# Altium schematic sheet Fri3d_2024_Exp0_01.SchDoc: Communicator Add-On
size A3; Date: 18/06/2024; DrawnBy: Wim Van Gool; DocumentNumber: 1; Revision: 01; SheetNumber: 1; SheetTotal: 2
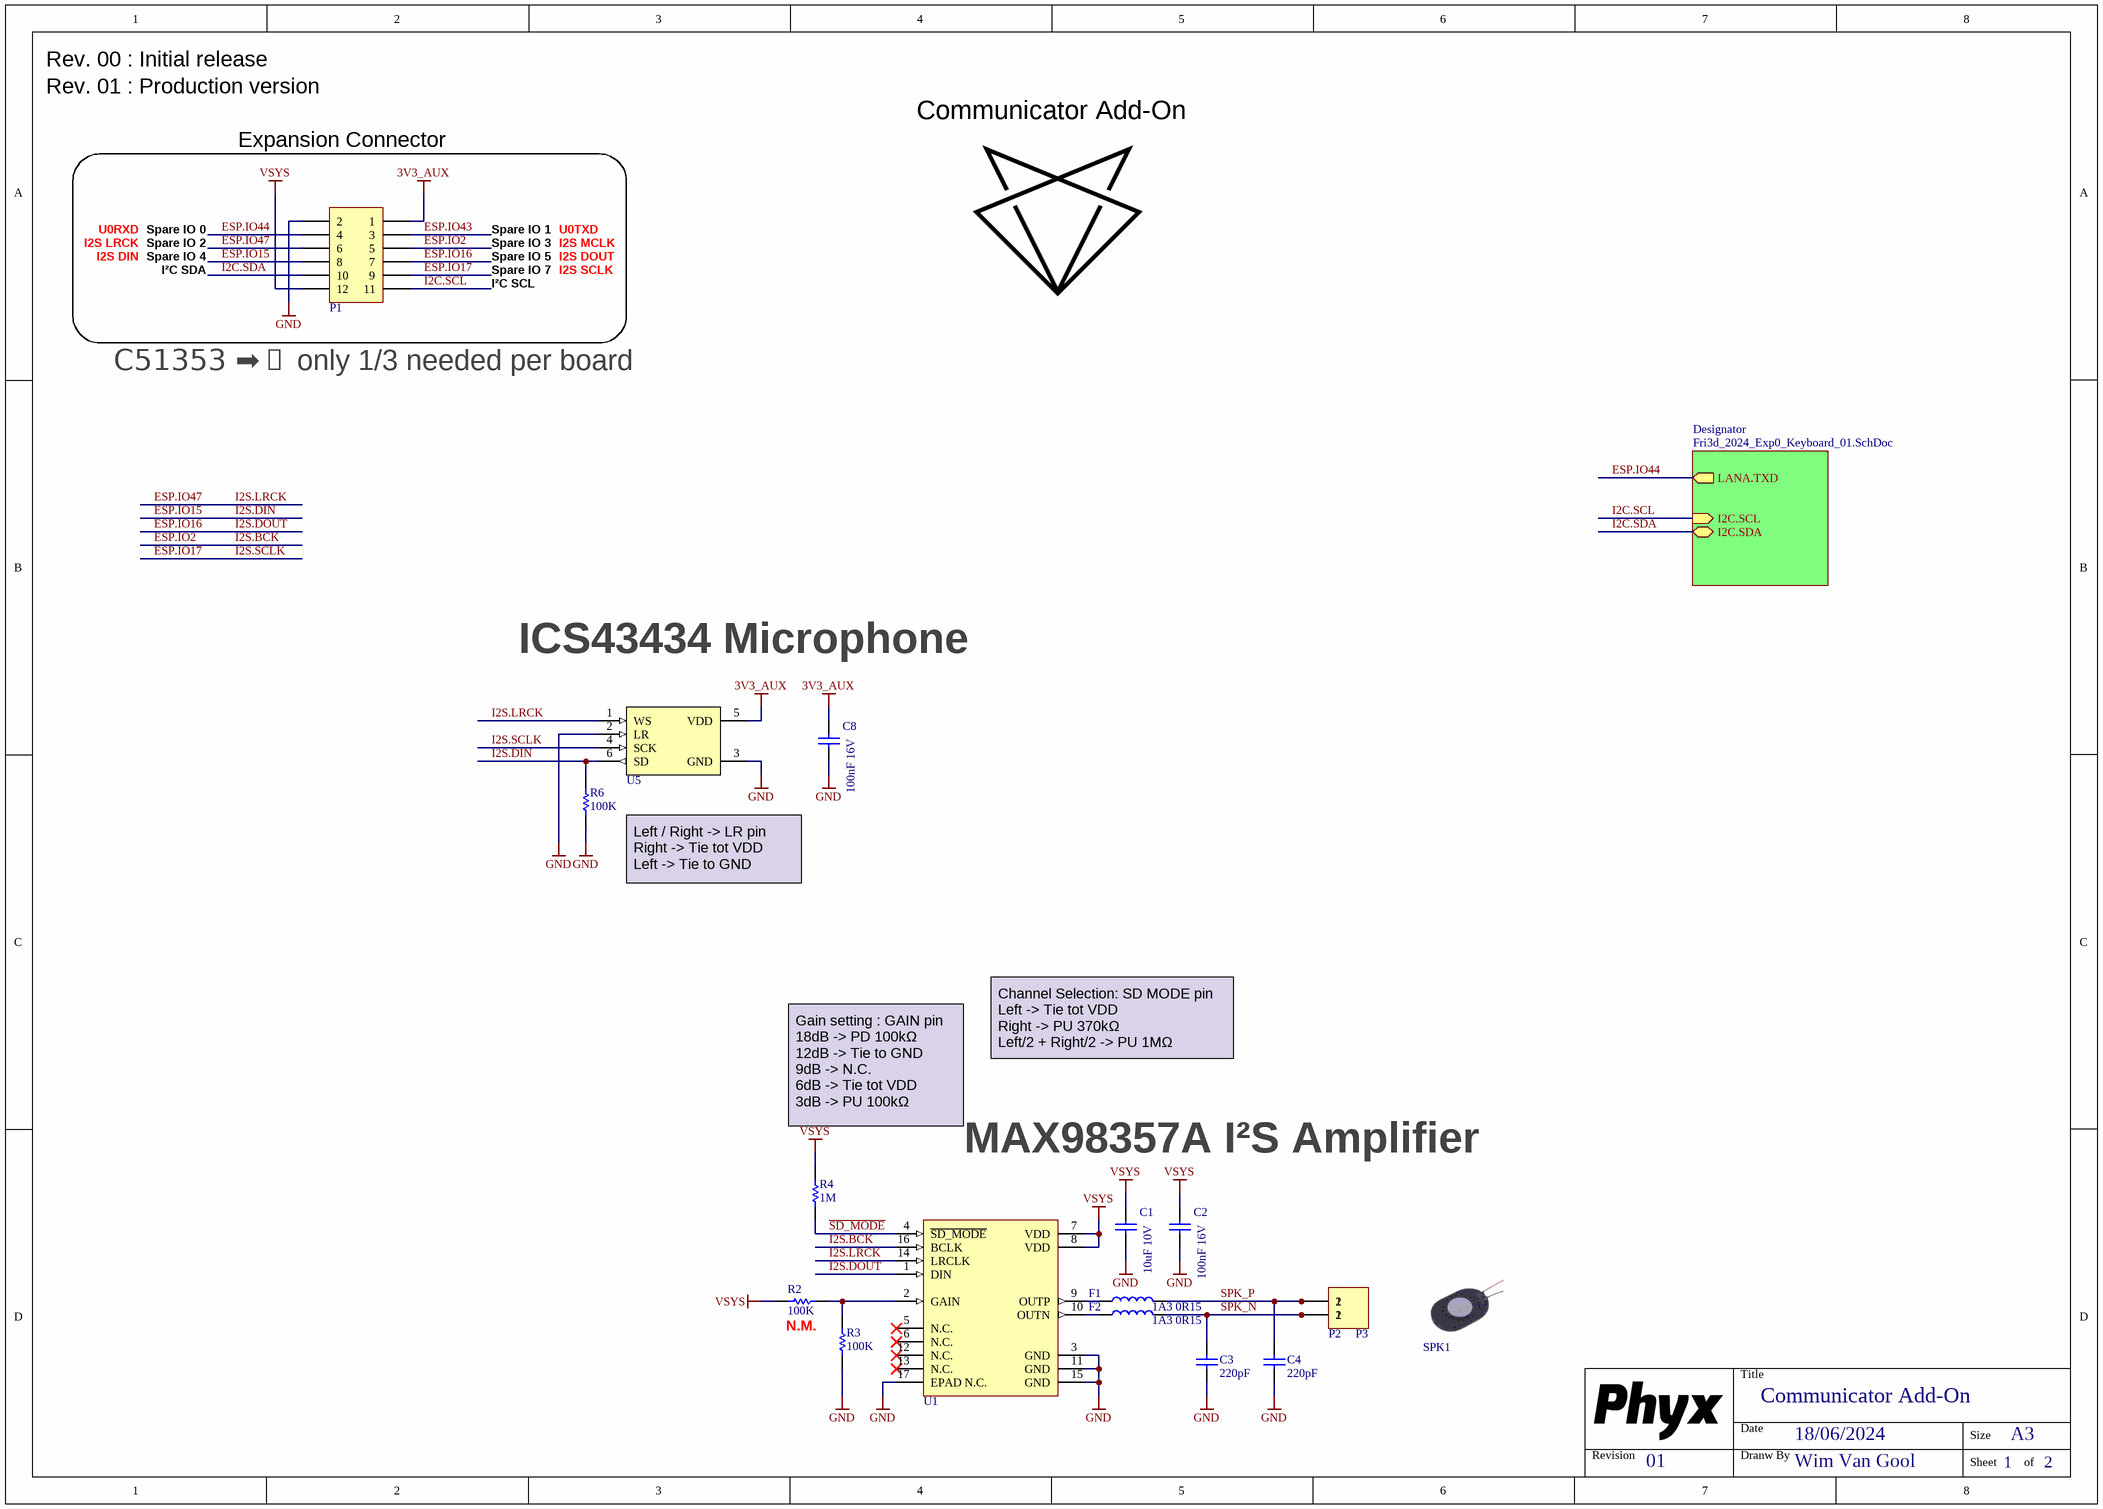
[diagram p0: Fri3d_2024_Exp0_01.SchDoc]

## Parts
C1  value 10uF 10V  [C0805_N]  (hidden comment: CAP_CERAMIC)
C2  value 100nF 16V  [C0603_N]
C3  value 220pF  [C0603_N]  (hidden comment: CAP_CERAMIC)
C4  value 220pF  [C0603_N]  (hidden comment: CAP_CERAMIC)
C8  value 100nF 16V  [C0603_N]
F1  value 1A3 0R15  [L0603]  (hidden comment: BLM18KG601SN1D)
F2  value 1A3 0R15  [L0603]  (hidden comment: BLM18KG601SN1D)
P1  Header 6X2  [HDR2X6]  (value not drawn)
P2  Header 2.0mm Shrouded 2  [WE_620102131822]  (value not drawn)
P3  Header 2 RA  [HDR1X2_RA]  (value not drawn)
R2  value 100K  [R0603_N]  (hidden comment: RESISTOR)
R3  value 100K  [R0603_N]  (hidden comment: RESISTOR)
R4  value 1M  [R0603_N]  (hidden comment: RESISTOR)
R6  value 100K  [R0603_N]  (hidden comment: RESISTOR)
SPK1  INGHAi GSPK3020035PN 8R 1W 100mm Leads  (value not drawn)
U1  Mono I²S DAC AMP 3W 2.5~5.5V  [QFN_16_0.5_3X3]  (value not drawn)
U5  I2S MIC ICS-43434  [TDK_ICS-43434]  (value not drawn)

## Blocks framed on the sheet
C51353 ➡️ only 1/3 needed per board: P1

## Sub-sheets
Designator = Fri3d_2024_Exp0_Keyboard_01.SchDoc: LANA.TXD (out), I2C.SCL (in), I2C.SDA (bidir)

## Nets
3V3_AUX: C8.1 P1.1 U5.5(VDD)
GND: C1.2 C2.2 C3.2 C4.2 C8.2 P1.2 R3.2 R6.2 U1.3(GND) U1.11(GND) U1.15(GND) U1.17(EPAD_N.C.) U5.2(LR) U5.3(GND)
VSYS: C1.1 C2.1 P1.12 R2.2 R4.1 U1.7(VDD) U1.8(VDD)
ESP.IO2: P1.5 U1.16(BCLK)  [also labelled I2S.BCK]
ESP.IO15: P1.8 R6.1 U5.6(SD)  [also labelled I2S.DIN]
ESP.IO16: P1.7 U1.1(DIN)  [also labelled I2S.DOUT]
ESP.IO17: P1.9 U5.4(SCK)  [also labelled I2S.SCLK]
ESP.IO43: P1.3
ESP.IO44: P1.4 ; sheet Designator/LANA.TXD
ESP.IO47: P1.6 U1.14(LRCLK) U5.1(WS)  [also labelled I2S.LRCK]
I2C.SCL: P1.11 ; sheet Designator/I2C.SCL
I2C.SDA: P1.10 ; sheet Designator/I2C.SDA
~{SD_MODE}: R4.2 U1.4(~{SD_MODE})
SPK_N: C3.1 F2.2 P2.2 P3.1
SPK_P: C4.1 F1.2 P2.1 P3.2
NetF1_1: F1.1 U1.9(OUTP)
NetF2_1: F2.1 U1.10(OUTN)
NetR2_1: R2.1 R3.1 U1.2(GAIN)

Not connected (* = marked no-connect by the designer): U1 5(N.C.)* 6(N.C.)* 12(N.C.)* 13(N.C.)*

## Notes on the sheet
- Rev. 00 : Initial release
- Rev. 01 : Production version
- Expansion Connector
- I2S LRCK
- I2S DIN
- U0RXD
- Spare IO 0
- Spare IO 2
- Spare IO 4
- Spare IO 1
- Spare IO 3
- Spare IO 5
- I2S MCLK
- I2S DOUT
- U0TXD
- I²C SDA
- I²C SCL
- Spare IO 7
- I2S SCLK
- ICS43434 Microphone
- Left / Right -> LR pin
  Right -> Tie tot VDD
  Left -> Tie to GND
- Channel Selection: SD MODE pin
  Left -> Tie tot VDD
  Right -> PU 370kΩ
  Left/2 + Right/2 -> PU 1MΩ
- Gain setting : GAIN pin
  18dB -> PD 100kΩ
  12dB -> Tie to GND
  9dB -> N.C.
  6dB -> Tie tot VDD
  3dB -> PU 100kΩ
- MAX98357A I²S Amplifier
- (near R2) N.M.
- Title
- Revision
- Date
- Dranw By
- Size
- A3
- Sheet
- of

## Library data of the parts
C1 = CAP # 10uF 10V 0805: Capacitor Ceramic; Supplier 1: Farnell; Supplier Part Number 1: 2320859
C2 C8 = CAP # 100nF 16V 0603: Capacitor Ceramic
C3 C4 = CAP # 220pF 50V 0603: Capacitor Ceramic; Supplier 1: LCSC; Supplier Part Number 1: C5254623; Supplier 2: LCSC; Supplier Part Number 2: C107081; Supplier 3: Generic; Supplier Part Number 3: 220pF 0603
F1 F2 = FER # 600R 1A3 0603 0R15 BLM18KG601SN1D: Supplier 1: Farnell; Supplier Part Number 1: 1781094
P1 = Pin Header 2.54mm dual row 12way
P2 = HDR # SHR 2.0mm 2way - 620102131822: Value: 620102131822; Supplier 1: Wurth; Supplier Part Number 1: 620102131822; Supplier 2: Mouser; Supplier Part Number 2: 710-620102131822
P3 = Pin Header 2.54mm 2way RA
R2 R3 R6 = RES # 100K 0603: Supplier 3: Generic; Supplier Part Number 3: 100K 1% 0603
R4 = RES # 1M 0603: Supplier 3: Generic; Supplier Part Number 3: 1M 1% 0603
SPK1 = SPEAKER 8R 1W 10cm: Value: GSPK3020035PN-8R1.0W-L100; Description: SPEAKER 8R 1W 10cm; Supplier 1: LCSC; Supplier Part Number 1: C530556
U1 = AMP # AUD MAX98357A: =Description; Value: MAX98357A; Supplier 1: Farnell; Supplier Part Number 1: 2949165
U5 = MIC # MEMS I2S ICS-43434: =Description; Value: ICS-43434; Supplier 1: Mouser; Supplier Part Number 1: 410-ICS-43434; Supplier 2: Farnell; Supplier Part Number 2: 2911502